# Altium schematic sheet Sheet2.SchDoc
size A
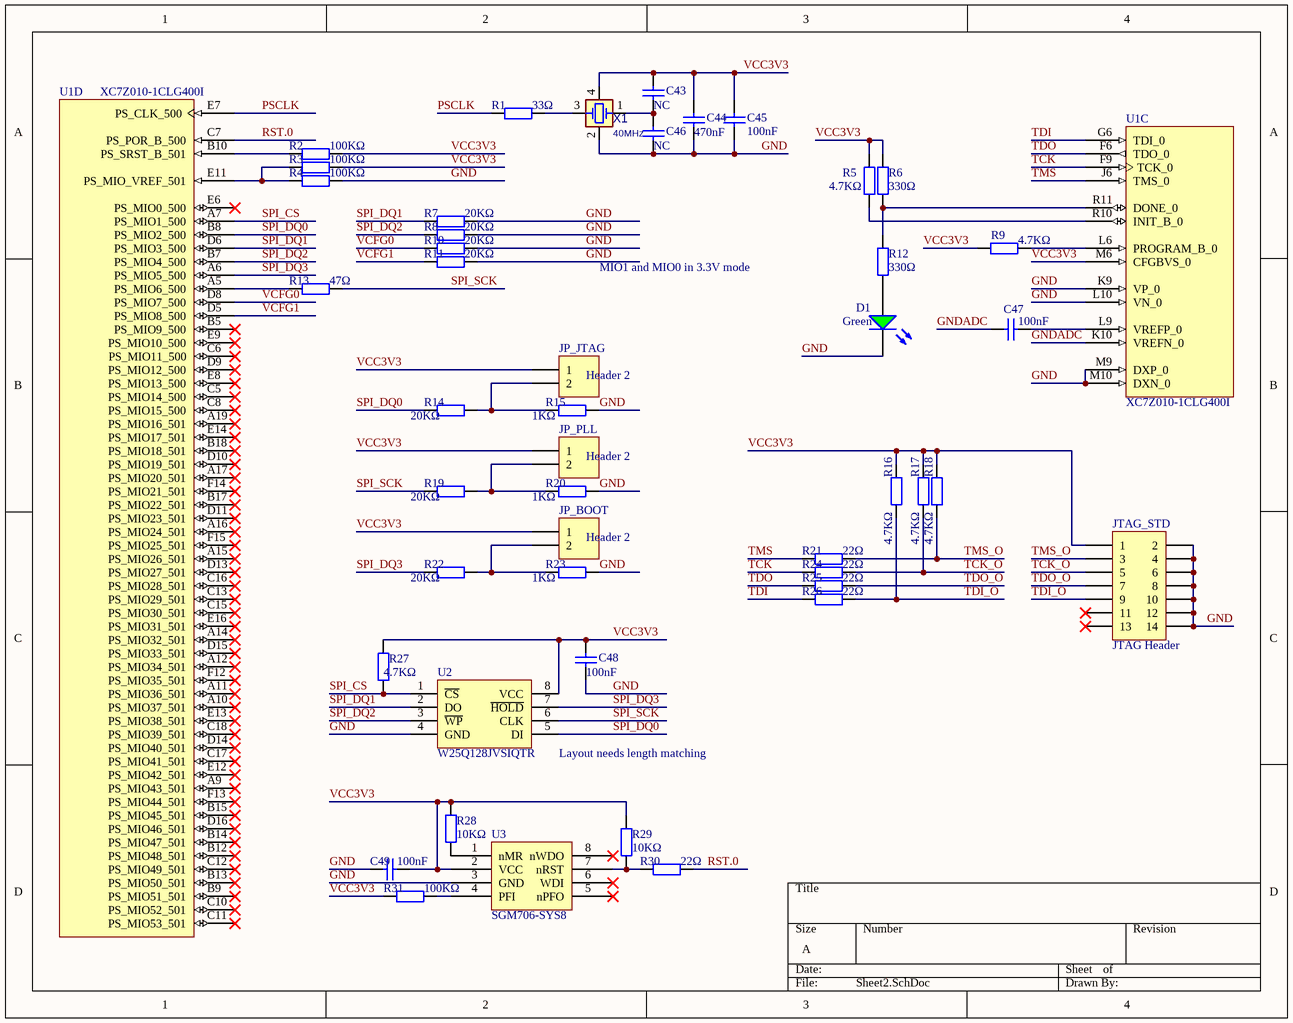
[diagram p0: Sheet2.SchDoc]

## Parts
C43  NC  [0402_C]
C44  470nF  [0402_C]
C45  100nF  [1206_C]
C46  NC  [0402_C]
C47  100nF  [1206_C]
C48  100nF  [1206_C]
C49  100nF  [1206_C]
D1  Green  [0805_LED_S1]
JP_BOOT  Header 2  [HDR1X2]
JP_JTAG  Header 2  [HDR1X2]
JP_PLL  Header 2  [HDR1X2]
JTAG_STD  JTAG Header  [HDR2X7]
R1  33Ω  [0603_R]
R2  100KΩ  [1206_R]
R3  100KΩ  [1206_R]
R4  100KΩ  [1206_R]
R5  4.7KΩ  [1206_R]
R6  330Ω  [0805_R]
R7  20KΩ  [0805_R]
R8  20KΩ  [0805_R]
R9  4.7KΩ  [1206_R]
R10  20KΩ  [0805_R]
R11  20KΩ  [0805_R]
R12  330Ω  [0805_R]
R13  47Ω  [0805_R]
R14  20KΩ  [0805_R]
R15  1KΩ  [1206_R]
R16  4.7KΩ  [1206_R]
R17  4.7KΩ  [1206_R]
R18  4.7KΩ  [1206_R]
R19  20KΩ  [0805_R]
R20  1KΩ  [1206_R]
R21  22Ω  [1206_R]
R22  20KΩ  [0805_R]
R23  1KΩ  [1206_R]
R24  22Ω  [1206_R]
R25  22Ω  [1206_R]
R26  22Ω  [1206_R]
R27  4.7KΩ  [1206_R]
R28  10KΩ  [1206_R]
R29  10KΩ  [1206_R]
R30  22Ω  [1206_R]
R31  100KΩ  [1206_R]
U1  XC7Z010-1CLG400I  [CLG400]  (parts C,D of 9)
U2  W25Q128JVSIQTR  [SOIC-8_208mil]
U3  SGM706-SYS8  [SOIC-8_150mil]
X1  40MHz  [XTL_4_3225]

## Nets
GND: C44.2 C45.1 C46.2 C48.1 C49.1 D1.K JTAG_STD.2 JTAG_STD.4 JTAG_STD.6 JTAG_STD.8 JTAG_STD.10 JTAG_STD.12 JTAG_STD.14 R4.2 R7.2 R8.2 R10.2 R11.2 R15.2 R20.2 R23.2 U1.K9(VP_0) U1.L10(VN_0) U1.M9(DXP_0) U1.M10(DXN_0) U2.4(GND) U3.3(GND) X1.2(GND1)
GNDADC: C47.1 U1.K10(VREFN_0)
PSCLK: R1.1 U1.E7(PS_CLK_500)
RST.0: R30.2 U1.C7(PS_POR_B_500)
SPI_CS: R27.1 U1.A7(PS_MIO1_500) U2.1(~{CS})
SPI_DQ0: R14.1 U1.B8(PS_MIO2_500) U2.5(DI)
SPI_DQ1: R7.1 U1.D6(PS_MIO3_500) U2.2(DO)
SPI_DQ2: R8.1 U1.B7(PS_MIO4_500) U2.3(~{WP})
SPI_DQ3: R22.1 U1.A6(PS_MIO5_500) U2.7(~{HOLD})
SPI_SCK: R13.2 R19.1 U2.6(CLK)
TCK: R24.1 U1.F9(TCK_0)
TCK_O: JTAG_STD.5 R17.1 R24.2
TDI: R26.1 U1.G6(TDI_0)
TDI_O: JTAG_STD.9 R16.1 R26.2
TDO: R25.1 U1.F6(TDO_0)
TDO_O: JTAG_STD.7 R25.2
TMS: R21.1 U1.J6(TMS_0)
TMS_O: JTAG_STD.3 R18.1 R21.2
VCC3V3: C43.1 C44.1 C45.2 C48.2 C49.2 JP_BOOT.1 JP_JTAG.1 JP_PLL.1 JTAG_STD.1 R2.2 R3.2 R5.2 R6.1 R9.1 R16.2 R17.2 R18.2 R27.2 R28.2 R29.2 R31.1 U1.M6(CFGBVS_0) U2.8(VCC) U3.2(VCC) X1.4(GND2)
VCFG0: R10.1 U1.D8(PS_MIO7_500)
VCFG1: R11.1 U1.D5(PS_MIO8_500)
NetC43_2: C43.2 C46.1 X1.1(XA)
NetC47_2: C47.2 U1.L9(VREFP_0)
NetD1_A: D1.A R12.1
NetJP_BOOT_2: JP_BOOT.2 R22.2 R23.1
NetJP_JTAG_2: JP_JTAG.2 R14.2 R15.1
NetJP_PLL_2: JP_PLL.2 R19.2 R20.1
NetR1_2: R1.2 X1.3(XB)
NetR2_1: R2.1 U1.B10(PS_SRST_B_501)
NetR3_1: R3.1 R4.1 U1.E11(PS_MIO_VREF_501)
NetR5_1: R5.1 U1.R10(INIT_B_0)
NetR6_2: R6.2 R12.2 U1.R11(DONE_0)
NetR9_2: R9.2 U1.L6(PROGRAM_B_0)
NetR13_1: R13.1 U1.A5(PS_MIO6_500)
NetR28_1: R28.1 U3.1(nMR)
NetR29_1: R29.1 R30.1 U3.7(nRST)
NetR31_2: R31.2 U3.4(PFI)

Not connected (* = marked no-connect by the designer): JTAG_STD 11* 13*; U1 A9(PS_MIO43_501)* A10(PS_MIO37_501)* A11(PS_MIO36_501)* A12(PS_MIO34_501)* A14(PS_MIO32_501)* A15(PS_MIO26_501)* A16(PS_MIO24_501)* A17(PS_MIO20_501)* A19(PS_MIO16_501)* B5(PS_MIO9_500)* B9(PS_MIO51_501)* B12(PS_MIO48_501)* B13(PS_MIO50_501)* B14(PS_MIO47_501)* B15(PS_MIO45_501)* B17(PS_MIO22_501)* B18(PS_MIO18_501)* C5(PS_MIO14_500)* C6(PS_MIO11_500)* C8(PS_MIO15_500)* C10(PS_MIO52_501)* C11(PS_MIO53_501)* C12(PS_MIO49_501)* C13(PS_MIO29_501)* C15(PS_MIO30_501)* C16(PS_MIO28_501)* C17(PS_MIO41_501)* C18(PS_MIO39_501)* D9(PS_MIO12_500)* D10(PS_MIO19_501)* D11(PS_MIO23_501)* D13(PS_MIO27_501)* D14(PS_MIO40_501)* D15(PS_MIO33_501)* D16(PS_MIO46_501)* E6(PS_MIO0_500)* E8(PS_MIO13_500)* E9(PS_MIO10_500)* E12(PS_MIO42_501)* E13(PS_MIO38_501)* E14(PS_MIO17_501)* E16(PS_MIO31_501)* F12(PS_MIO35_501)* F13(PS_MIO44_501)* F14(PS_MIO21_501)* F15(PS_MIO25_501)*; U3 5(nPFO)* 6(WDI)* 8(nWDO)*

## Notes on the sheet
- MIO1 and MIO0 in 3.3V mode
- (near U2) Layout needs length matching
- Title
- Size:
- Date:
- A
- Number:
- Time:
- Revision:
- Sheet
- of
- File:

## Library data of the parts
C43 C44 C46 = 0402 470nF (474) 10% 10V: 贴片电容; ComponentLink1Description: 供应商链接; ComponentLink1URL: http://www.szlcsc.com/product/details_48344.html; Package: 0402; Supplier: LC; SuppliersPartNumber: C47339
C45 C47-C49 = 1206 100nF (104) 10% 50V: 贴片电容; ComponentLink1Description: 供应商链接; ComponentLink1URL: http://www.szlcsc.com/product/details_25237.html; Package: 1206; Supplier: LC; SuppliersPartNumber: C24497
D1 = 0805 翠绿: 发光二极管; ComponentLink1Description: 供应商链接; ComponentLink1URL: http://www.szlcsc.com/product/details_2670.html; Package: 0805; Supplier: LC; SuppliersPartNumber: C2297
JP_BOOT JP_JTAG JP_PLL = Header 2: Header, 2-Pin; LatestRevisionDate: 17-Jul-2002; LatestRevisionNote: Re-released for DXP Platform.; Publisher: Altium Limited
JTAG_STD = Header 7X2: Header, 7-Pin, Dual row; LatestRevisionDate: 17-Jul-2002; LatestRevisionNote: Re-released for DXP Platform.; Publisher: Altium Limited
R1 = 0603 33Ω (33R0) 1%: 贴片电阻; ComponentLink1Description: 供应商链接; ComponentLink1URL: http://www.szlcsc.com/product/details_23867.html; Package: 0603; Supplier: LC; SuppliersPartNumber: C23140
R2-R4 R31 = 1206 100KΩ (1003) 1%: 贴片电阻; ComponentLink1Description: 供应商链接; ComponentLink1URL: http://www.szlcsc.com/product/details_18588.html; Package: 1206; Supplier: LC; SuppliersPartNumber: C17900
R5 R9 R16-R18 R27 = 1206 4.7KΩ (4701) 1%: 贴片电阻; ComponentLink1Description: 供应商链接; ComponentLink1URL: http://www.szlcsc.com/product/details_18624.html; Package: 1206; Supplier: LC; SuppliersPartNumber: C17936
R6 R12 = 0805 330Ω (3300) 1%: 贴片电阻; ComponentLink1Description: 供应商链接; ComponentLink1URL: http://www.szlcsc.com/product/details_18318.html; Package: 0805; Supplier: LC; SuppliersPartNumber: C17630
R7 R8 R10 R11 R14 R19 R22 = 0805 20KΩ (2002) 1%: 贴片电阻; ComponentLink1Description: 供应商链接; ComponentLink1URL: http://www.szlcsc.com/product/details_4735.html; Package: 0805; Supplier: LC; SuppliersPartNumber: C4328
R13 = 0805 47Ω (47R0) 1%: 贴片电阻; ComponentLink1Description: 供应商链接; ComponentLink1URL: http://www.szlcsc.com/product/details_18402.html; Package: 0805; Supplier: LC; SuppliersPartNumber: C17714
R15 R20 R23 = 1206 1KΩ (1001) 1%: 贴片电阻; ComponentLink1Description: 供应商链接; ComponentLink1URL: http://www.szlcsc.com/product/details_4817.html; Package: 1206; Supplier: LC; SuppliersPartNumber: C4410
R21 R24-R26 R30 = 1206 22Ω (22R0) 1%: 贴片电阻; ComponentLink1Description: 供应商链接; ComponentLink1URL: http://www.szlcsc.com/product/details_18646.html; Package: 1206; Supplier: LC; SuppliersPartNumber: C17958
R28 R29 = 1206 10KΩ (1002) 1%: 贴片电阻; ComponentLink1Description: 供应商链接; ComponentLink1URL: http://www.szlcsc.com/product/details_18590.html; Package: 1206; Supplier: LC; SuppliersPartNumber: C17902
U1 = XC7Z010-1CLG400I: 667 MHz Zynq?7000 AP SoC, 130 PS I/O, 100 FPGA I/O, 400-Ball BGA, Speed Grade 1, Industrial Grade, Pb-Free; Manufacturer: Xilinx; Extensible Block RAM (# 36Kb Blocks): 240 KB (60); Flip Flops: 35200; LUTs: 17600; Speed Grade: -1; DatasheetVersion: v1.2; PackageVersion: Rev 1.1; PackageReference: CLG400; PackageDescription: Wire-Bond Chip-Scale BGA, Body 17 x 17 mm, 0.8 mm Pitch; Generic Part Number: XC7Z010; RoHS: Pb-Free; Mounting Technology: Surface Mount; Code_JEDEC: MO-275-MMAA-1; PartNumber: XC7Z010-1CLG400I; ComponentLink1Description: Datasheet; ComponentLink1URL: http://www.xilinx.com/support/documentation/data_sheets/ds190-Zynq-7000-Overview.pdf; ComponentLink2Description: Package Specification; ComponentLink2URL: http://www.xilinx.com/support/documentation/user_guides/ug865-Zynq-7000-Pkg-Pinout.pdf; ComponentLink3Description: DC and AC Switching Characteristics; ComponentLink3URL: http://www.xilinx.com/support/documentation/data_sheets/ds187-XC7Z010-XC7Z020-Data-Sheet.pdf; ComponentLink4Description: Package File; ComponentLink4URL: http://www.xilinx.com/support/packagefiles/z7packages/xc7z010clg400pkg.txt; ComponentLink5Description: Packaging and Pinout; ComponentLink5URL: http://www.xilinx.com/support/documentation/user_guides/ug865-Zynq-7000-Pkg-Pinout.pdf; ComponentLink6Description: PCB and Layout Guide; ComponentLink6URL: http://www.xilinx.com/support/documentation/user_guides/ug483_7Series_PCB.pdf
U2 = W25Q128JVSIQTR_[C97521]: Flash ROM; ComponentLink1Description: 供应商链接; ComponentLink1URL: https://item.szlcsc.com/98729.html; Package: SOIC-8; Supplier: LC; SuppliersPartNumber: C97521
U3 = EEPROM/AT24C256C-SSHL-T_[C6482]: MCU  Supervisor, 150mil SOP-8; ComponentLink1Description: 供应商链接; ComponentLink1URL: http://www.szlcsc.com/product/details_6947.html; Package: SOIC-8_150mil; Supplier: LC; SuppliersPartNumber: C6482
X1 = XTL_4_40MHz_3225A: CRYSTAL 40.00 MHZ 4pF, 10PPM; MANF: ABRACON; DESC: X1E000021036701; DIST#: MOUSER; MANF_P#: ABM8W-40.0000MHZ-4-B1U-T3; PARAM2: 4pF, 40OhmESR; PARAM: 10PPM, -20~70oC; ASSEMBLY: ASSEMBLY; PRICE: 0.6$; VALUE: 40MHz